# EAGLE design Power Supply (EAGLE 9.6.2)
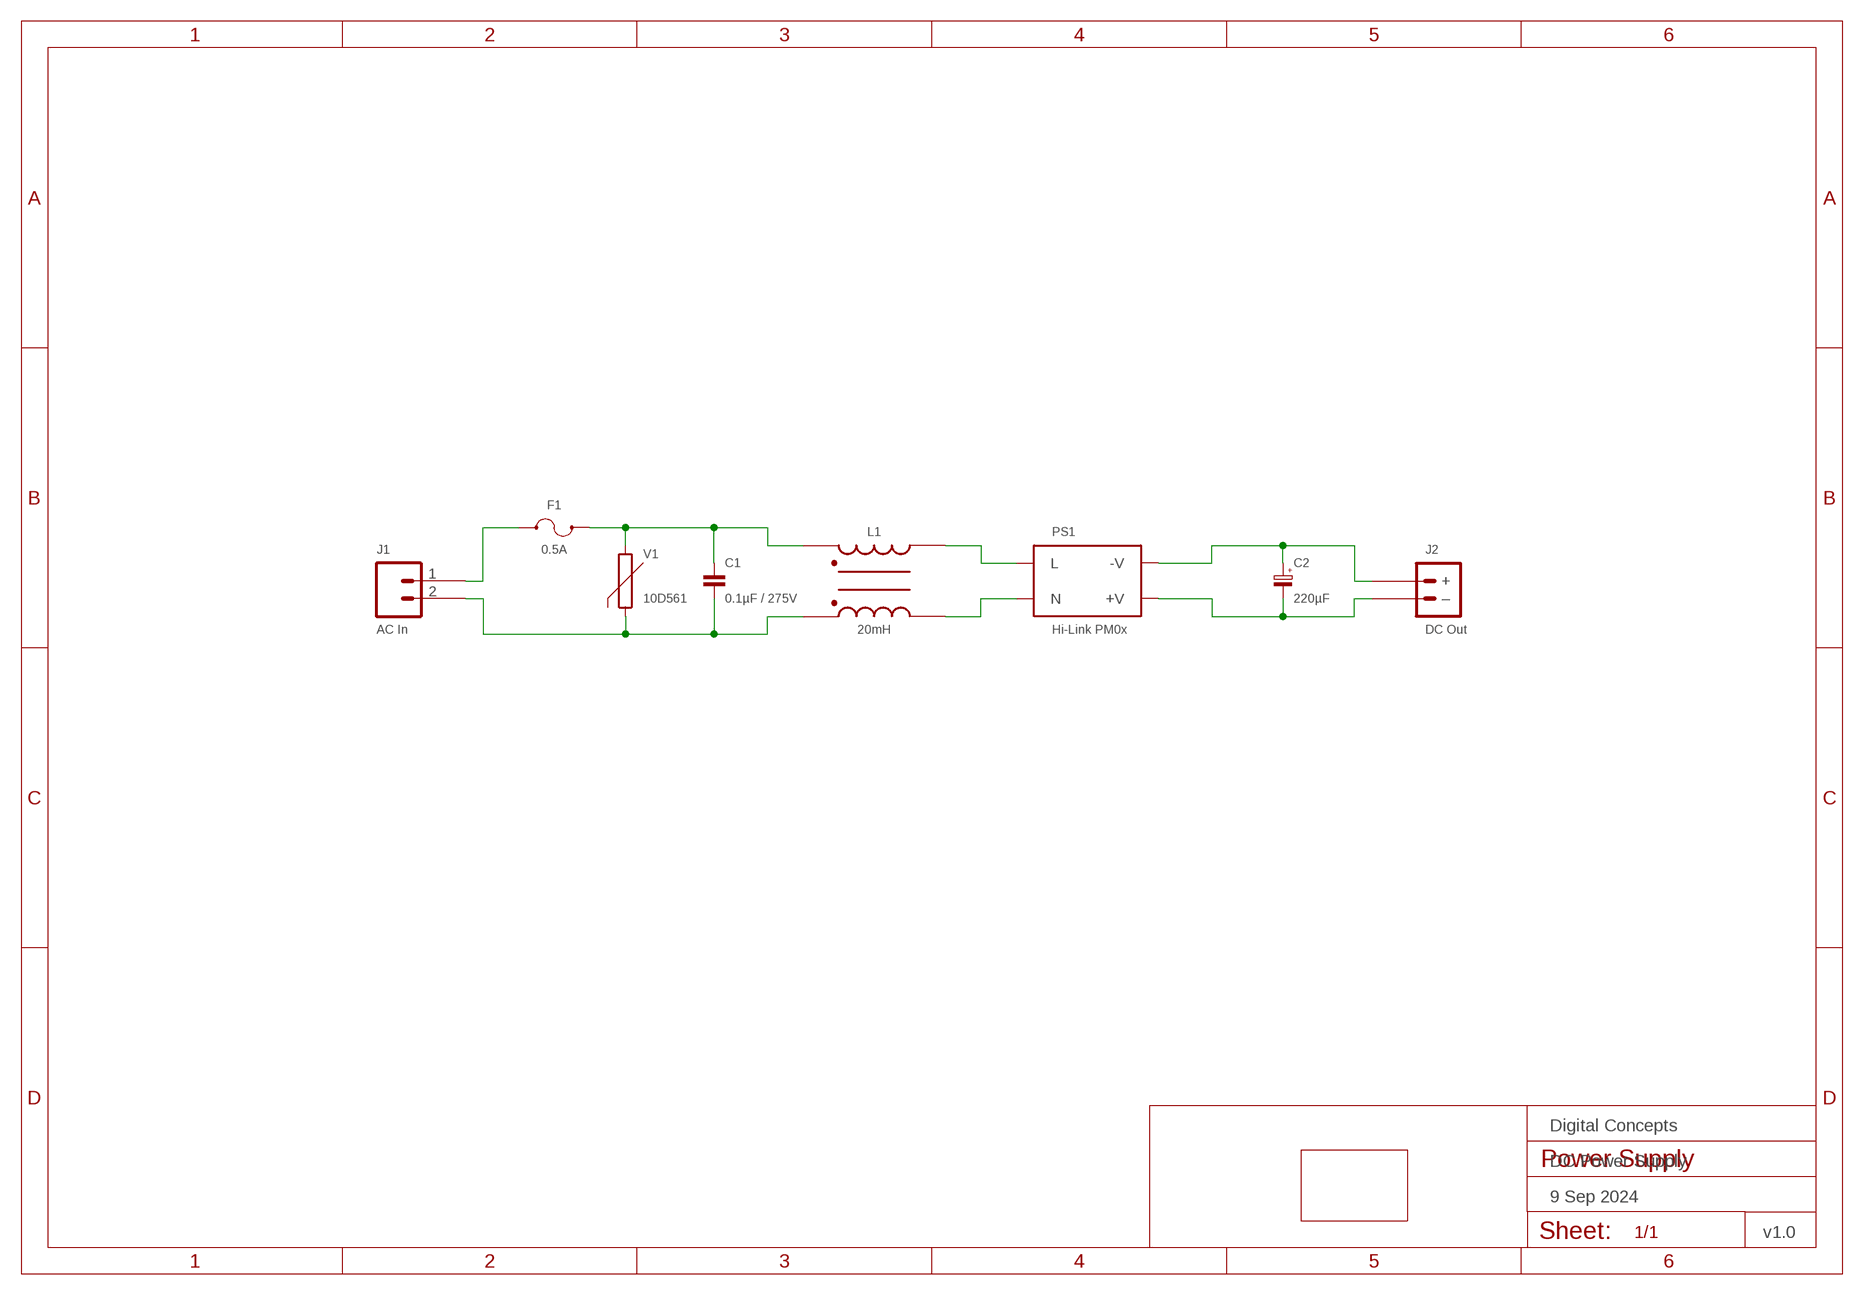
[diagram p0: schematic, sheet 1]
FRAME2 (FRAME-A4L-LOC): DATE: 9 Sep 2024; OWNER: Digital Concepts; TITLE: DC Power Supply; VERSION: v1.0

## Parts
C1  0.1µF / 275V  CAPACITOR-TENTA-SUPPRESSION  [CAPACITOR-TENTA-SUPPRESSION]
C2  220µF  CAPACITOR-ELECTROLYTICE5-10.5  [E5-10,5]
F1  0.5A  FUSE-HOLDER-1808  [FUSE-HOLDER-1808]
J1  AC In  JST-XH2.54-2-HORIZONTAL  [JST-XH2.4-2-HORIZONTAL]
J2  DC Out  JST-PH2.0-2-VERTICAL-POWER  [JST-PH2.0-2-VERTICAL-POWER]
L1  20mH  INDUCTOR-COMMON-MODE-UU9.8  [INDUCTOR-UU9.8]
PCB1  PCB-OUTLINE-64X31  [PCB-POWER-SUPPLY]
PS1  Hi-Link PM0x  HI-LINK-POWER-SUPPLY  [HI-LINK]
V1  10D561  VARISTOR-10D561  [VARISTOR-10D561]

## Nets
N$1: F1.P$1 J1.1
N$2: C1.P$1 F1.P$2 L1.P$1 V1.2
N$3: L1.P$2 PS1.AC-L(L)
N$4: C1.P$2 J1.2 L1.P$4 V1.1
N$5: L1.P$3 PS1.AC-N(N)
N$6: C2.+ J2.+ PS1.-VO(-V)
N$7: C2.- J2.-(–) PS1.+VO(+V)

## Library data of the parts
C1 = digitalconcepts:CAPACITOR-TENTA-SUPPRESSION: MEX/TENTA Interference Suppression Capacitor
C2 = digitalconcepts:CAPACITOR-ELECTROLYTIC: Electrolytic Capacitor; SPICEPREFIX: C
F1 = digitalconcepts:FUSE-HOLDER-1808: 1808 Fuse Holder
J1 = digitalconcepts:JST-XH2.54-2-HORIZONTAL: XH2.54 2P Horizontal Connector
J2 = digitalconcepts:JST-PH2.0-2-VERTICAL-POWER: JST PH2.0 2P PTH Connector (Power)
L1 = digitalconcepts:INDUCTOR-COMMON-MODE-UU9.8: UU9.8 Common Mode Inductor
PCB1 = digitalconcepts:PCB-OUTLINE-64X31: Power Supply PCB Outline (64 x 31)
PS1 = digitalconcepts:HI-LINK-POWER-SUPPLY: Hi-Link Power Supply Module
V1 = digitalconcepts:VARISTOR-10D561: VARISTOR

## Board
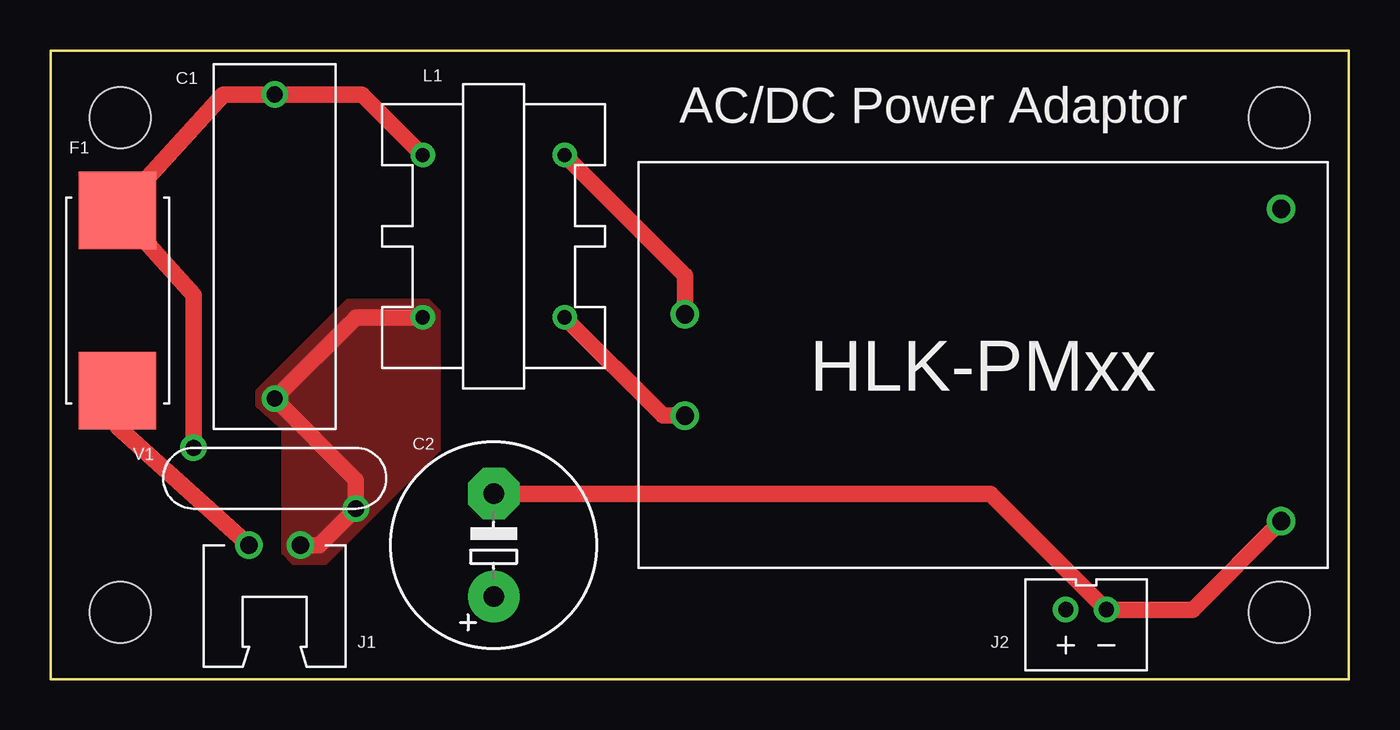
[diagram p1: board, top side]
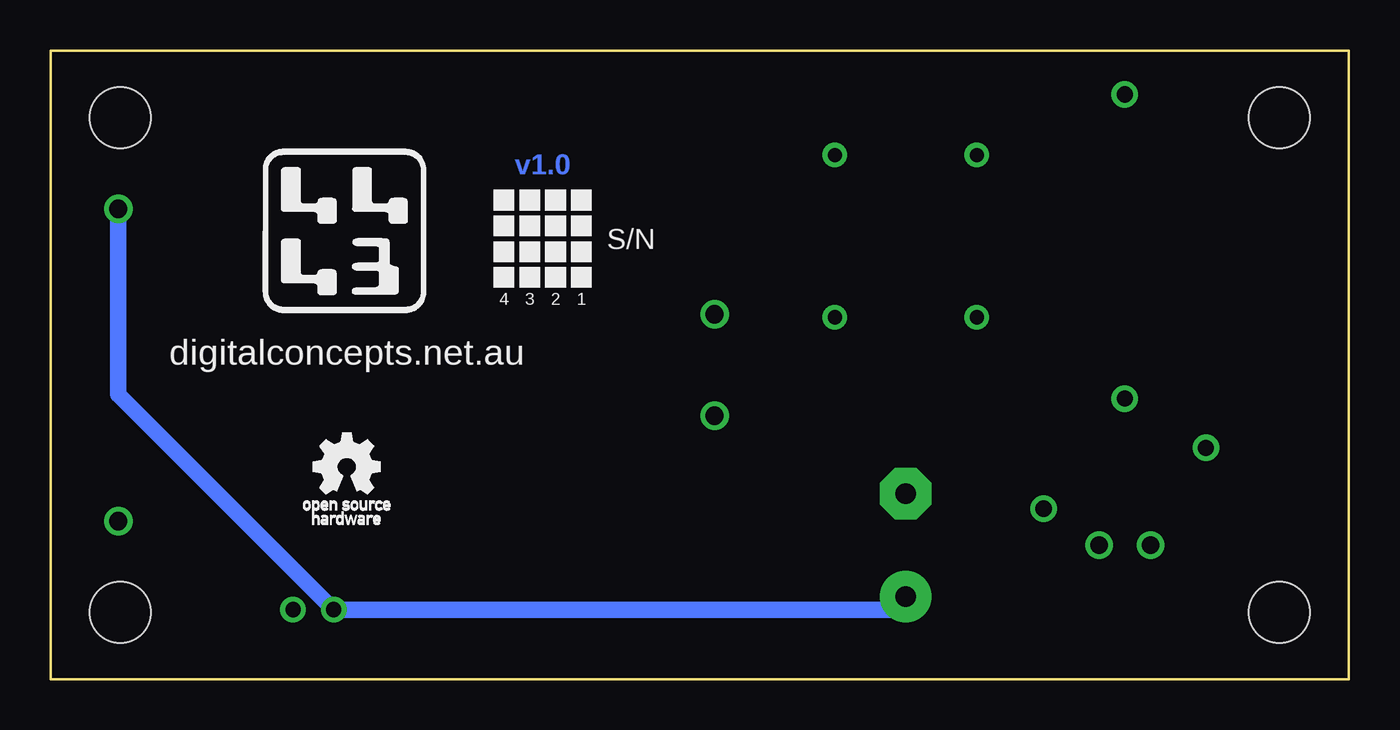
[diagram p2: board, bottom side, seen from below]

Size 64 x 31 mm. Coordinates in mm from the lower left corner, seen from the top.
Copper layers (1*16): Top 0.035mm / dielectric 1.5mm / Bottom 0.035mm
Design rules "default *": minimum track width 6mil, minimum drill 0.35mm, track to track 6mil, track to pad 6mil, pad to pad 6mil, via to via 6mil, smd to smd 6mil, copper to edge 6mil, drill to drill 6mil, minimum pad ring 10mil, minimum via ring 8mil, stop-mask expansion 4mil, vias tented up to drill 0mil, thermal gap 10mil

### Footprints (pad centres in the part's own frame; a part is rotated, then mirrored left to right if it is on the bottom)
CAPACITOR-TENTA-SUPPRESSION = drill 0.8: P$1 -7.5,0; P$2 7.5,0
E5-10,5 = drill 1.016 pad 2.54: + -2.54,0 | drill 1.016 pad 2.54 octagon: - 2.54,0
FUSE-HOLDER-1808 = smd 3.81 x 3.81: P$1 -4.445,0; P$2 4.445,0
JST-XH2.4-2-HORIZONTAL = drill 0.85: 1 1.27,0; 2 -1.27,0
JST-PH2.0-2-VERTICAL-POWER = drill 0.75: + -1,0; - 1,0
INDUCTOR-UU9.8 = drill 0.7: P$1 -3.5,4; P$2 3.5,4; P$3 3.5,-4; P$4 -3.5,-4
PCB-POWER-SUPPLY = hole 3: -28.575,12.192; -28.575,-12.192; 28.575,-12.192; 28.575,12.192
HI-LINK = drill 0.9: +VO 14.7,-7.7; -VO 14.7,7.7; AC-L -14.7,2.5; AC-N -14.7,-2.5
VARISTOR-10D561 = drill 0.8: 1 -4,1.5; 2 4,-1.5

### Placement (x,y rotation side)
C1  11.04,21.34 270 top
C2  21.84,6.61 90 top
F1  3.3,18.68 90 top
J1  11.04,6.61 180 top
J2  51.05,3.44 0 top
L1  21.84,21.85 0 top
PCB1  32,15.5 0 top
PS1  45.97,15.5 0 top
V1  11.04,9.91 180 top

### Tracks (layer width: path | path; a pad name or v marks a point on that pad's centre or on a via)
N$1
  Top 0.813: J1.1 3.3,12.45 F1.P$1
N$2
  Top 0.813: L1.P$1 15.35,28.84 C1.P$1 8.51,28.84 F1.P$2 7.04,18.94 V1.2
N$3
  Top 0.813: PS1.AC-L 31.27,19.92 L1.P$2
N$4
  Top 0.813: L1.P$4 15.05,17.85 C1.P$2 15.04,9.84 V1.1 13.24,6.61 J1.2
  pour Top (no thermals): 18.66,18.68 14.6,18.68 10.16,14.23 10.16,13.48 11.43,12.34 11.43,6.23 11.93,5.72 13.58,5.72 19.17,11.31 19.17,18.17
N$5
  Top 0.813: PS1.AC-N 30.19,13 L1.P$3
N$6
  Bottom 0.813: C2.+ 22.47,3.44 J2.+ 60.67,14.05 PS1.-VO
N$7
  Top 0.813: C2.- 46.34,9.15 J2.- 56.3,3.44 PS1.+VO

### Text on the board
Bottom: v1.0
bPlace: S/N | 1 | 2 | 3 | 4 | digitalconcepts.net.au
tNames: AC/DC Power Adaptor